# EAGLE schematic esp32board (EAGLE 9.1.2)

## Sheet 1 of 2
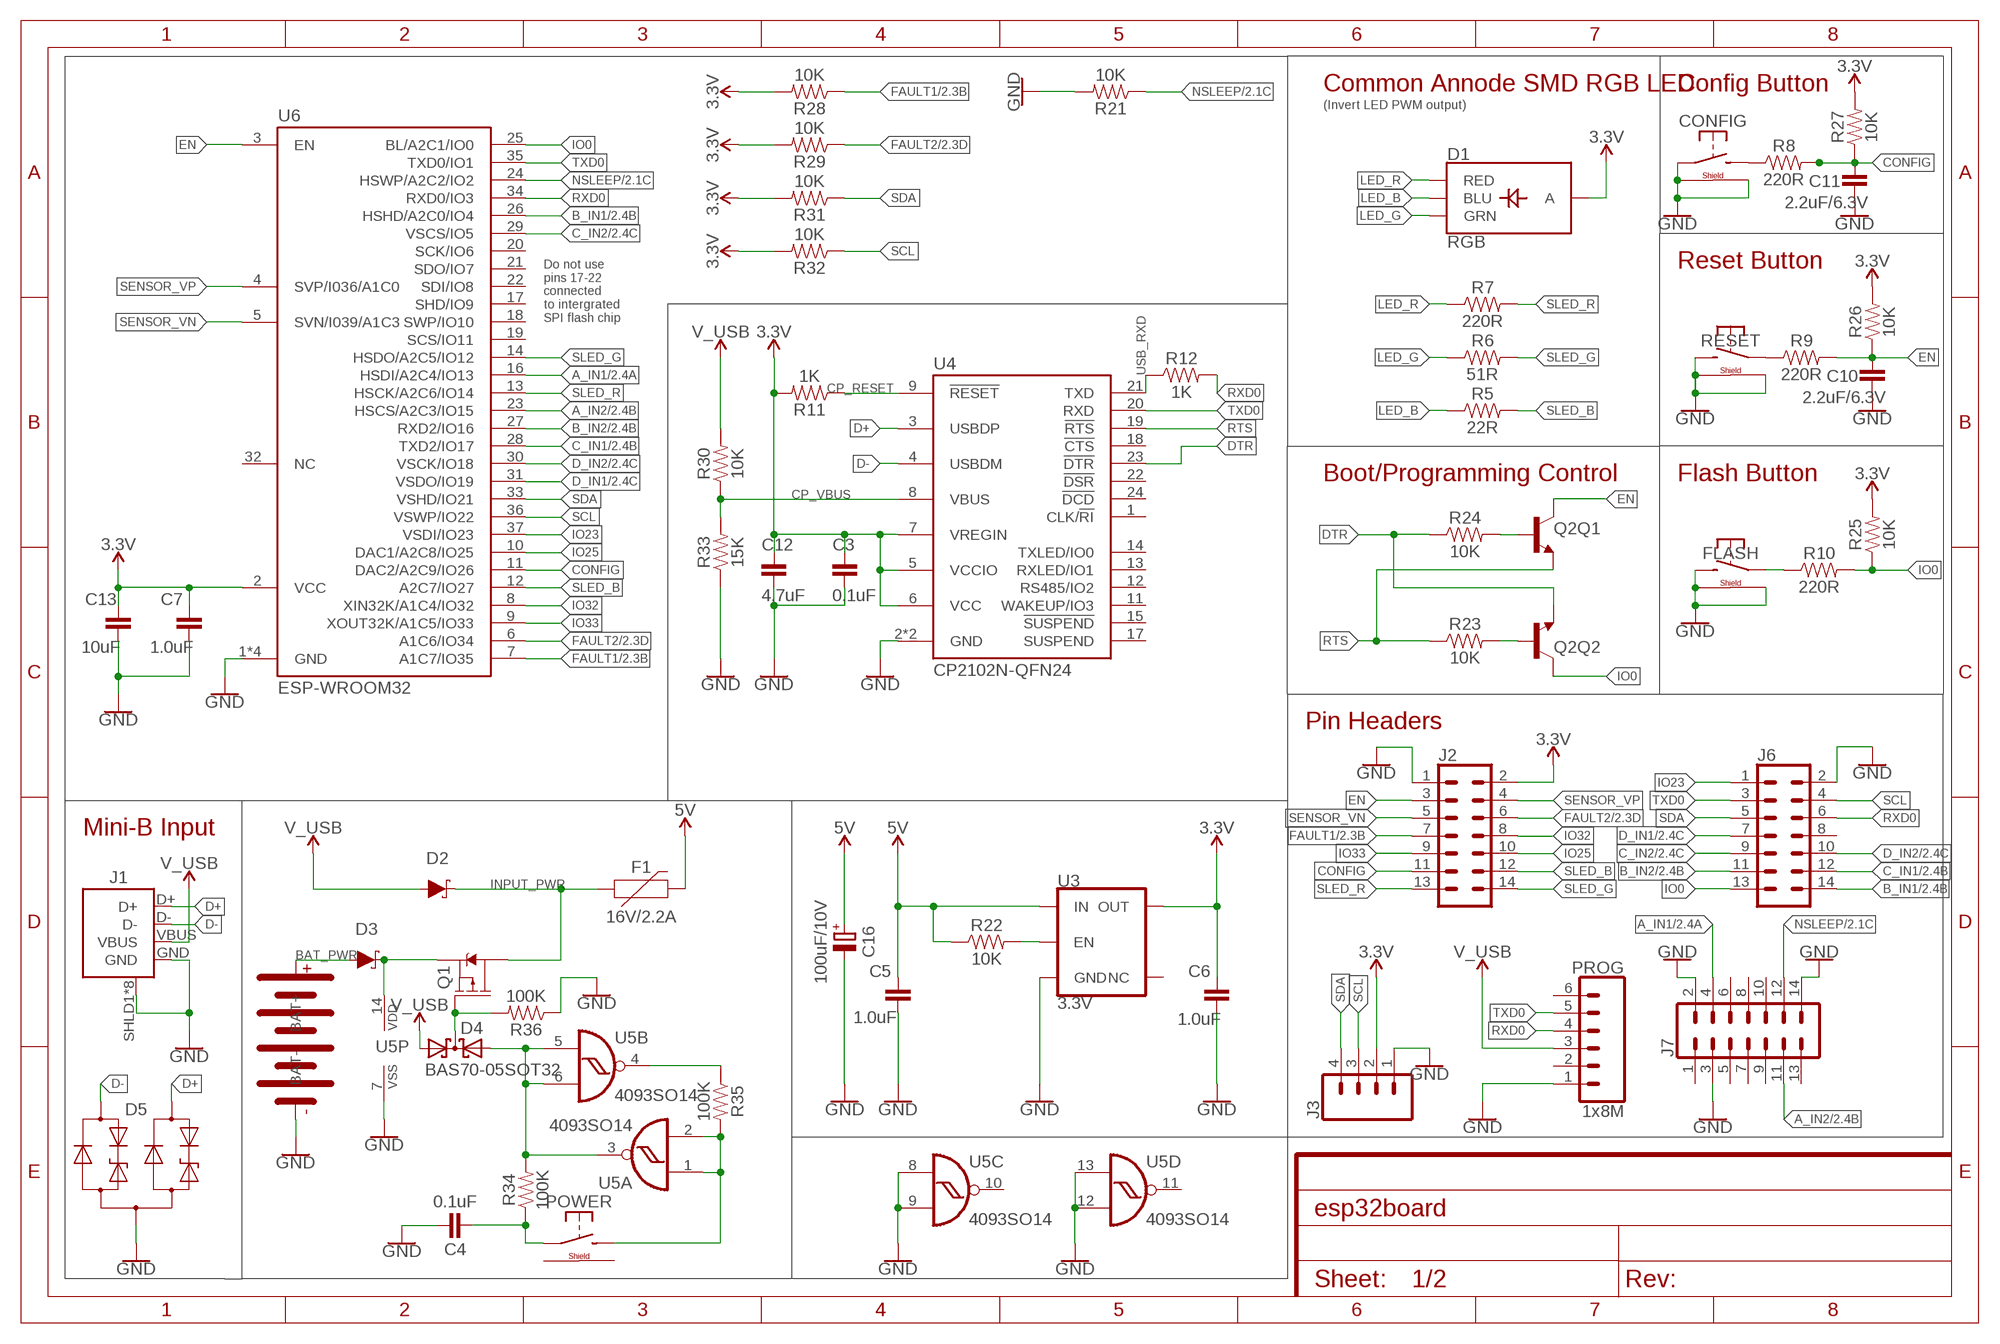
[diagram p0: schematic, sheet 1]
FRAME1 (FRAME-A4L): CNAME: VibHub ESP8266 Devboard; CREVISION: 0.1; DESIGNER: Kadah

### Parts
BAT  BC4AAPCBC4AAPC  [BC4AAPC]
C3  0.1uF  CAPACITOR-0805  [C0805]
C4  0.1uF  CAPACITOR-0805  [C0805]
C5  1.0uF  CAPACITOR-0805  [C0805]
C6  1.0uF  CAPACITOR-0805  [C0805]
C7  1.0uF  CAPACITOR-0805  [C0805]
C10  2.2uF/6.3V  CAPACITOR-0805  [C0805]
C11  2.2uF/6.3V  CAPACITOR-0805  [C0805]
C12  4.7uF  CAPACITOR-0805  [C0805]
C13  10uF  CAPACITOR-0805  [C0805]
C16  100uF/10V  CAPACITOR_POLPANASONIC_D  [PANASONIC_D]
CONFIG  MOMENTARY-SWITCH-SPST-RIGHTSQ75  [SW6X6_RIGHT_SQ73]
D1  RGB  LED-RGB-CAPLCC  [P-LCC-4-3]
D2  3A/40V/500mV  DIODE-SCHOTTKY-B340A  [SMA-DIODE]
D3  3A/40V/500mV  DIODE-SCHOTTKY-B340A  [SMA-DIODE]
D4  BAS70-05SOT32  [SOT91P240X110-3]
D5  D_ESD5V3U2U-03F  [SOT723]
F1  16V/2.2A  PPTC1812  [FUSC7035X90]
FLASH  MOMENTARY-SWITCH-SPST-RIGHTSQ75  [SW6X6_RIGHT_SQ73]
J1  USB-MICROB-2  [USB-MICROB-10118194]
J2  CONN_07X2  [2X7]
J3  CONN_04  [1X04]
J6  CONN_07X2  [2X7]
J7  CONN_07X2  [2X7]
POWER  MOMENTARY-SWITCH-SPST-RIGHTSQ75  [SW6X6_RIGHT_SQ73]
PROG  1x8M  CONN_06LOCK  [1X06_LOCK]
Q1  MOSFET_PCH-DMG2305UX-13  [SOT91P240X110-3]
Q2  TRANS_NPN_DUAL-MBT3904DW1T1  [SC70-6]
R5  22R  RESISTOR0805  [0805]
R6  51R  RESISTOR0805  [0805]
R7  220R  RESISTOR0805  [0805]
R8  220R  RESISTOR0805  [0805]
R9  220R  RESISTOR0805  [0805]
R10  220R  RESISTOR0805  [0805]
R11  1K  RESISTOR0805  [0805]
R12  1K  RESISTOR0805  [0805]
R21  10K  RESISTOR0805  [0805]
R22  10K  RESISTOR0805  [0805]
R23  10K  RESISTOR0805  [0805]
R24  10K  RESISTOR0805  [0805]
R25  10K  RESISTOR0805  [0805]
R26  10K  RESISTOR0805  [0805]
R27  10K  RESISTOR0805  [0805]
R28  10K  RESISTOR0805  [0805]
R29  10K  RESISTOR0805  [0805]
R30  10K  RESISTOR0805  [0805]
R31  10K  RESISTOR0805  [0805]
R32  10K  RESISTOR0805  [0805]
R33  15K  RESISTOR0805  [0805]
R34  100K  RESISTOR0805  [0805]
R35  100K  RESISTOR0805  [0805]
R36  100K  RESISTOR0805  [0805]
RESET  MOMENTARY-SWITCH-SPST-RIGHTSQ75  [SW6X6_RIGHT_SQ73]
U3  3.3V  V_REG_AP2112K-3.3V  [SOT23-5]
U4  CP2102N-QFN24  [QFN24-PAD]
U5  4093SO14  [SOIC127P600X175-14]
U6  ESP-WROOM32  [ESP-WROOM32]

### Nets
3.3V: C3.1 C6.1 C7.1 C12.1 C13.1 D1.4(A) J2.2 J3.2 R11.2 R25.2 R26.2 R27.2 R28.2 R29.2 R31.2 R32.2 U3.5(OUT) U4.5(VCCIO) U4.6(VCC) U4.7(VREGIN) U6.2(VCC)
5V: C5.1 C16.+ F1.2 R22.1 U3.1(IN) ; also sheet 2
A_IN1: J7.4 U6.16(HSDI/A2C4/IO13) ; also sheet 2
A_IN2: J7.11 U6.23(HSCS/A2C3/IO15) ; also sheet 2
B_IN1: J6.14 U6.26(HSHD/A2C0/IO4) ; also sheet 2
B_IN2: J6.11 U6.27(RXD2/IO16) ; also sheet 2
BAT_PWR: BAT.P$1(BAT+) D3.A
C_IN1: J6.12 U6.28(TXD2/IO17) ; also sheet 2
C_IN2: J6.9 U6.29(VSCS/IO5) ; also sheet 2
CONFIG: C11.1 J2.11 R8.2 R27.1 U6.11(DAC2/A2C9/IO26)
CP_RESET: R11.1 U4.9(!RESET)
CP_VBUS: R30.1 R33.2 U4.8(VBUS)
D+: D5.2(C2) J1.D+ U4.3(USBDP)
D-: D5.1(C1) J1.D- U4.4(USBDM)
D_IN1: J6.7 U6.31(VSDO/IO19) ; also sheet 2
D_IN2: J6.10 U6.30(VSCK/IO18) ; also sheet 2
DTR: Q2.1(Q2:E) R24.1 U4.23(!DTR)
EN: C10.1 J2.3 Q2.3(Q1:C) R9.2 R26.1 U6.3(EN)
EN_BASE: Q2.5(Q1:B) R24.2
FAULT1: J2.7 R28.1 U6.7(A1C7/IO35) ; also sheet 2
FAULT2: J2.6 R29.1 U6.6(A1C6/IO34) ; also sheet 2
GND: BAT.P$2(BAT-) C3.2 C4.2 C5.2 C6.2 C7.2 C10.2 C11.2 C12.2 C13.2 C16.- CONFIG.2(P1) CONFIG.SHLD@1(SHIELD1) CONFIG.SHLD@2(SHIELD2) D5.3(A) FLASH.1(S1) FLASH.SHLD@1(SHIELD1) FLASH.SHLD@2(SHIELD2) J1.GND J1.SHLD1(SHIELD) J1.SHLD2(SHIELD) J1.SHLD3(SHIELD) J1.SHLD4(SHIELD) J1.SHLD5(SHIELD) J1.SHLD6(SHIELD) J1.SHLD7(SHIELD) J1.SHLD8(SHIELD) J2.1 J3.1 J6.2 J7.2 J7.3 J7.14 PROG.1 R21.2 R33.1 R36.1 RESET.1(S1) RESET.SHLD@1(SHIELD1) RESET.SHLD@2(SHIELD2) U3.2(GND) U4.2(GND) U4.TP(GND) U5.7(P:VSS) U5.8(C:I0) U5.9(C:I1) U5.12(D:I1) U5.13(D:I0) U6.1(GND) U6.15(GND) U6.38(GND) U6.TP(GND) ; also sheet 2
INPUT_PWR: D2.C F1.1 Q1.3(D)
IO0: J6.13 Q2.6(Q2:C) R10.2 R25.1 U6.25(BL/A2C1/IO0)
IO0_BASE: Q2.2(Q2:B) R23.2
IO23: J6.1 U6.37(VSDI/IO23)
IO25: J2.10 U6.10(DAC1/A2C8/IO25)
IO32: J2.8 U6.8(XIN32K/A1C4/IO32)
IO33: J2.9 U6.9(XOUT32K/A1C5/IO33)
LED_B: D1.3(BLU) R5.1
LED_G: D1.2(GRN) R6.1
LED_R: D1.1(RED) R7.1
N$1: R22.2 U3.3(EN)
N$10: D3.C Q1.2(S) U5.14(P:VDD)
N$11: POWER.1(S1) R35.2 U5.1(A:I0) U5.2(A:I1)
N$12: CONFIG.1(S1) R8.1
N$13: D4.2(A2) R34.2 U5.3(A:O) U5.5(B:I0) U5.6(B:I1)
N$15: D4.3(C) Q1.1(G) R36.2
N$16: R35.1 U5.4(B:O)
N$18: C4.1 POWER.2(P1) R34.1
N$31: FLASH.2(P1) R10.1
N$37: R9.1 RESET.2(P1)
NSLEEP: J7.12 R21.1 U6.24(HSWP/A2C2/IO2) ; also sheet 2
RTS: Q2.4(Q1:E) R23.1 U4.19(!RTS)
RXD0: J6.6 PROG.4 R12.2 U6.34(RXD0/IO3)
SCL: J3.3 J6.4 R32.1 U6.36(VSWP/IO22)
SDA: J3.4 J6.5 R31.1 U6.33(VSHD/IO21)
SENSOR_VN: J2.5 U6.5(SVN/I039/A1C3)
SENSOR_VP: J2.4 U6.4(SVP/I036/A1C0)
SLED_B: J2.12 R5.2 U6.12(A2C7/IO27)
SLED_G: J2.14 R6.2 U6.14(HSDO/A2C5/IO12)
SLED_R: J2.13 R7.2 U6.13(HSCK/A2C6/IO14)
TXD0: J6.3 PROG.5 U4.20(RXD) U6.35(TXD0/IO1)
USB_RXD: R12.1 U4.21(TXD)
V_USB: D2.A D4.1(A1) J1.VBUS PROG.3 R30.2
Unconnected: J6.8 J7.1 J7.5 J7.6 J7.7 J7.8 J7.9 J7.10 J7.13 POWER.SHLD@1(SHIELD1) POWER.SHLD@2(SHIELD2) PROG.2 PROG.6 U3.4(NC) U4.1(CLK/!RI) U4.11(WAKEUP/IO3) U4.12(RS485/IO2) U4.13(RXLED/IO1) U4.14(TXLED/IO0) U4.15(!SUSPEND) U4.17(SUSPEND) U4.18(!CTS) U4.22(!DSR) U4.24(!DCD) U5.10(C:O) U5.11(D:O) U6.17(SHD/IO9) U6.18(SWP/IO10) U6.19(SCS/IO11) U6.20(SCK/IO6) U6.21(SDO/IO7) U6.22(SDI/IO8) U6.32(NC)

### Notes on the sheet
- Common Annode SMD RGB LED | Config Button
- (Invert LED PWM output)
- Reset Button
- Do not use
  pins 17-22
  connected
  to intergrated
  SPI flash chip
- Boot/Programming Control | Flash Button
- Pin Headers
- Mini-B Input

## Sheet 2 of 2
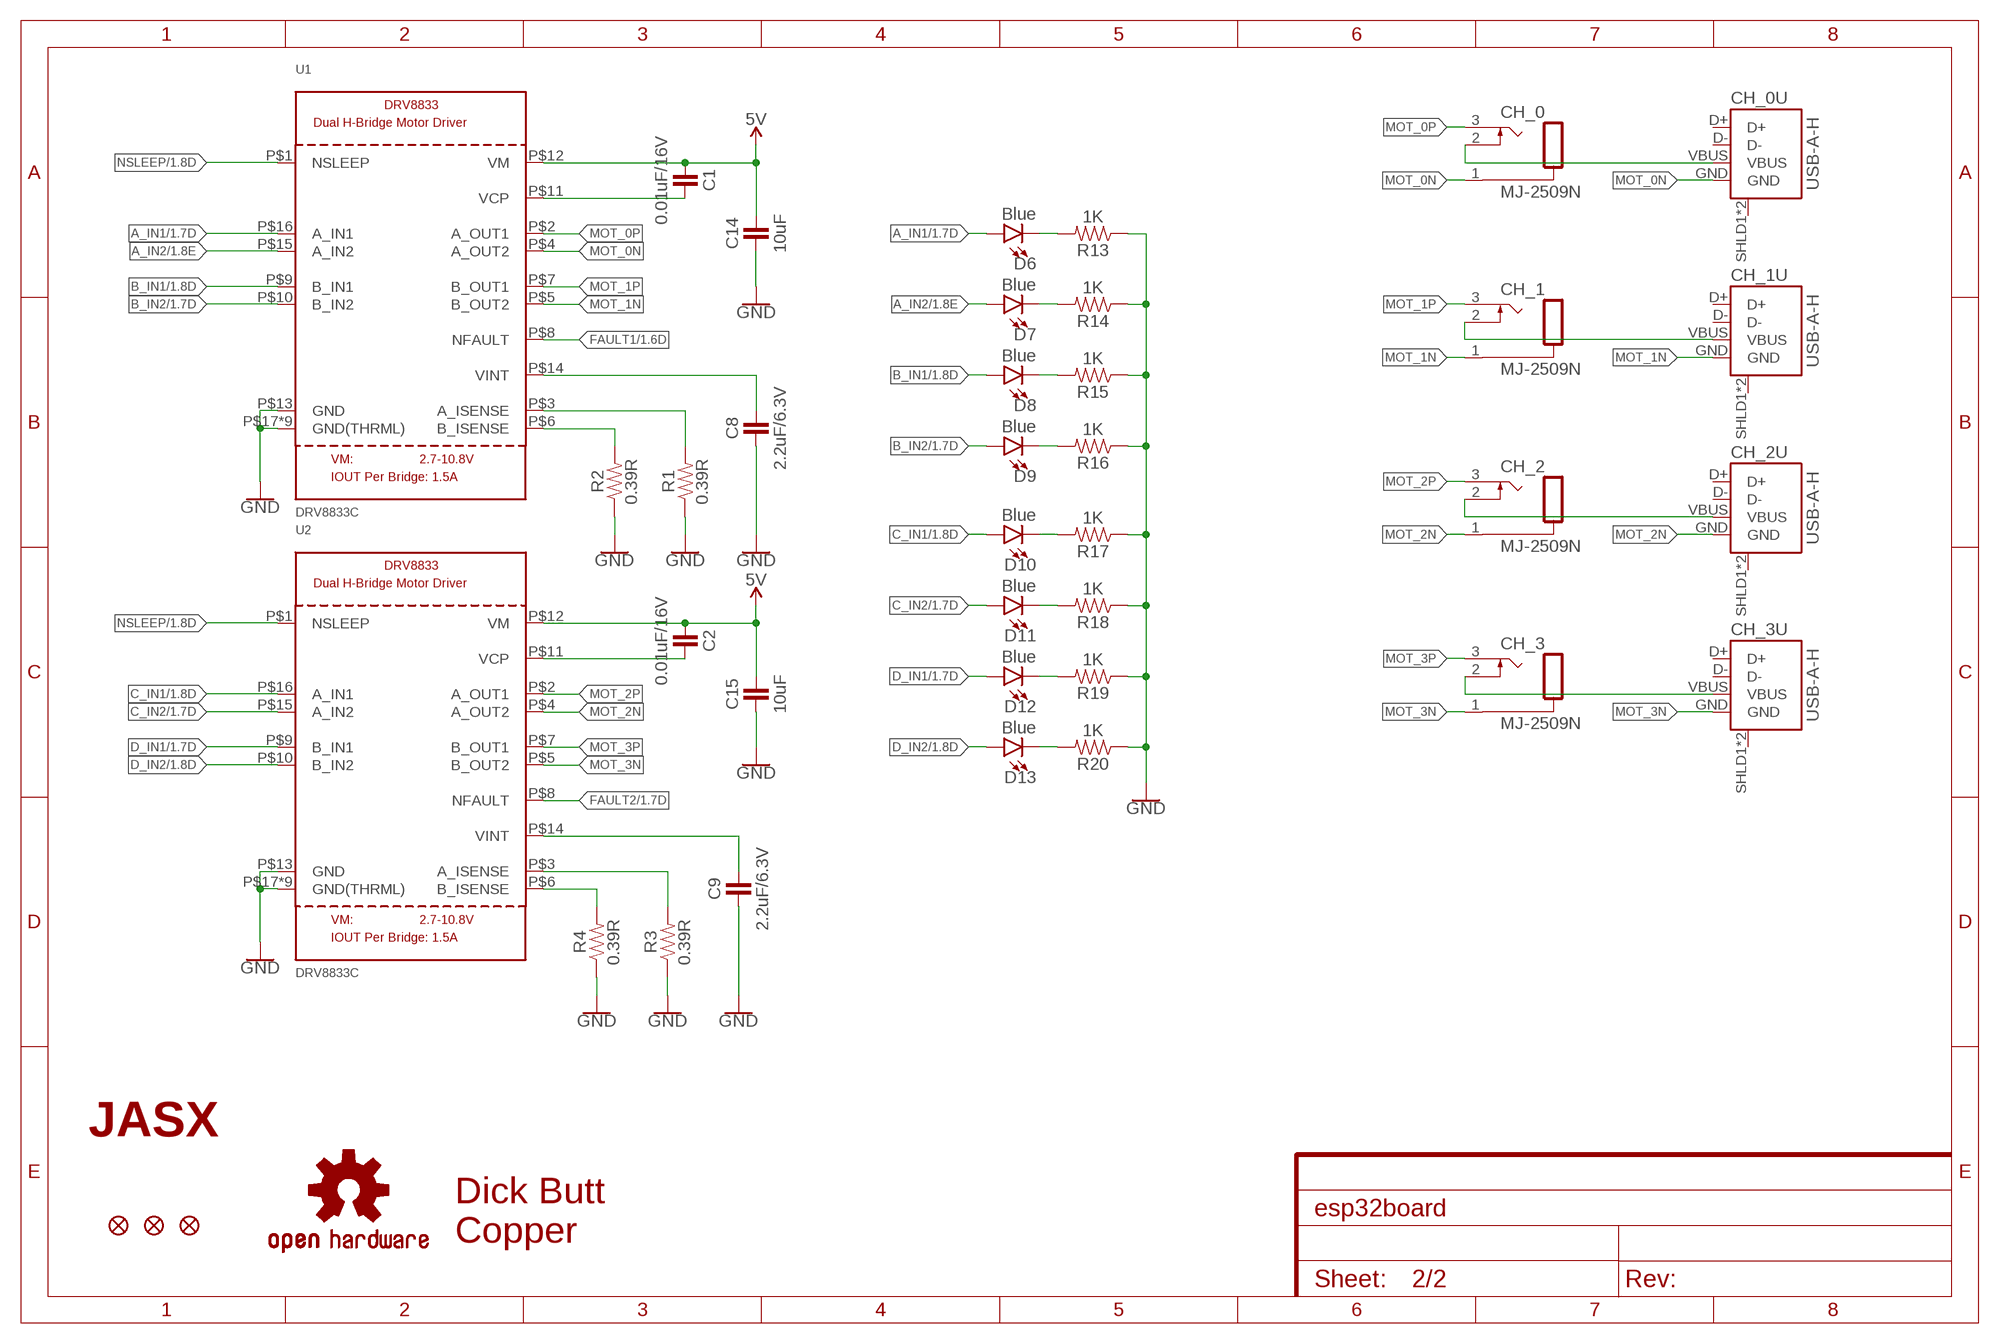
[diagram p1: schematic, sheet 2]

### Parts
C1  0.01uF/16V  CAPACITOR-0805  [C0805]
C2  0.01uF/16V  CAPACITOR-0805  [C0805]
C8  2.2uF/6.3V  CAPACITOR-0805  [C0805]
C9  2.2uF/6.3V  CAPACITOR-0805  [C0805]
C14  10uF  CAPACITOR-0805  [C0805]
C15  10uF  CAPACITOR-0805  [C0805]
CH_0  MJ-2509N  [MJ-2509N]
CH_0U  USB-A-H  [USB-A-H]
CH_1  MJ-2509N  [MJ-2509N]
CH_1U  USB-A-H  [USB-A-H]
CH_2  MJ-2509N  [MJ-2509N]
CH_2U  USB-A-H  [USB-A-H]
CH_3  MJ-2509N  [MJ-2509N]
CH_3U  USB-A-H  [USB-A-H]
D6  Blue  LED0805  [CHIPLED_0805]
D7  Blue  LED0805  [CHIPLED_0805]
D8  Blue  LED0805  [CHIPLED_0805]
D9  Blue  LED0805  [CHIPLED_0805]
D10  Blue  LED0805  [CHIPLED_0805]
D11  Blue  LED0805  [CHIPLED_0805]
D12  Blue  LED0805  [CHIPLED_0805]
D13  Blue  LED0805  [CHIPLED_0805]
FD1  FIDUCIAL1X2  [FIDUCIAL-1X2]
FD2  FIDUCIAL1X2  [FIDUCIAL-1X2]
FD3  FIDUCIAL1X2  [FIDUCIAL-1X2]
LOGO1  OSHW-LOGOM  [OSHW-LOGO-M]
LOGO2  JASX_LOGO_MID  [JASX_LOGO_M]
LOGO3  DICKBUTTCOPPER  [DICKBUTT_COPPER]
R1  0.39R  RESISTOR0805  [0805]
R2  0.39R  RESISTOR0805  [0805]
R3  0.39R  RESISTOR0805  [0805]
R4  0.39R  RESISTOR0805  [0805]
R13  1K  RESISTOR0805  [0805]
R14  1K  RESISTOR0805  [0805]
R15  1K  RESISTOR0805  [0805]
R16  1K  RESISTOR0805  [0805]
R17  1K  RESISTOR0805  [0805]
R18  1K  RESISTOR0805  [0805]
R19  1K  RESISTOR0805  [0805]
R20  1K  RESISTOR0805  [0805]
U1  DRV8833C  DRV8833  [HTSSOP16]
U2  DRV8833C  DRV8833  [HTSSOP16]

### Nets
5V: C1.1 C2.1 C14.2 C15.2 U1.P$12(VM) U2.P$12(VM) ; also sheet 1
A_IN1: D6.A U1.P$16(A_IN1) ; also sheet 1
A_IN2: D7.A U1.P$15(A_IN2) ; also sheet 1
A_ISENSE0: R1.2 U1.P$3(A_ISENSE)
A_ISENSE1: R3.2 U2.P$3(A_ISENSE)
B_IN1: D8.A U1.P$9(B_IN1) ; also sheet 1
B_IN2: D9.A U1.P$10(B_IN2) ; also sheet 1
B_ISENSE0: R2.2 U1.P$6(B_ISENSE)
B_ISENSE1: R4.2 U2.P$6(B_ISENSE)
C_IN1: D10.A U2.P$16(A_IN1) ; also sheet 1
C_IN2: D11.A U2.P$15(A_IN2) ; also sheet 1
D_IN1: D12.A U2.P$9(B_IN1) ; also sheet 1
D_IN2: D13.A U2.P$10(B_IN2) ; also sheet 1
FAULT1: U1.P$8(NFAULT) ; also sheet 1
FAULT2: U2.P$8(NFAULT) ; also sheet 1
GND: C8.1 C9.1 C14.1 C15.1 R1.1 R2.1 R3.1 R4.1 R13.1 R14.1 R15.1 R16.1 R17.1 R18.1 R19.1 R20.1 U1.P$13(GND) U1.P$17(GND(THRML)) U1.P$18(GND(THRML)) U1.P$19(GND(THRML)) U1.P$20(GND(THRML)) U1.P$21(GND(THRML)) U1.P$22(GND(THRML)) U1.P$23(GND(THRML)) U1.P$24(GND(THRML)) U1.P$25(GND(THRML)) U2.P$13(GND) U2.P$17(GND(THRML)) U2.P$18(GND(THRML)) U2.P$19(GND(THRML)) U2.P$20(GND(THRML)) U2.P$21(GND(THRML)) U2.P$22(GND(THRML)) U2.P$23(GND(THRML)) U2.P$24(GND(THRML)) U2.P$25(GND(THRML)) ; also sheet 1
MOT_0N: CH_0.1(S) CH_0U.GND U1.P$4(A_OUT2)
MOT_0P: CH_0.3(T) U1.P$2(A_OUT1)
MOT_1N: CH_1.1(S) CH_1U.GND U1.P$5(B_OUT2)
MOT_1P: CH_1.3(T) U1.P$7(B_OUT1)
MOT_2N: CH_2.1(S) CH_2U.GND U2.P$4(A_OUT2)
MOT_2P: CH_2.3(T) U2.P$2(A_OUT1)
MOT_3N: CH_3.1(S) CH_3U.GND U2.P$5(B_OUT2)
MOT_3P: CH_3.3(T) U2.P$7(B_OUT1)
N$2: D6.C R13.2
N$3: D7.C R14.2
N$4: D8.C R15.2
N$5: D9.C R16.2
N$6: D10.C R17.2
N$7: D11.C R18.2
N$8: D12.C R19.2
N$9: D13.C R20.2
N$14: CH_3.2(TS) CH_3U.VBUS
N$32: CH_0.2(TS) CH_0U.VBUS
N$33: CH_1.2(TS) CH_1U.VBUS
N$34: CH_2.2(TS) CH_2U.VBUS
NSLEEP: U1.P$1(NSLEEP) U2.P$1(NSLEEP) ; also sheet 1
VCP0: C1.2 U1.P$11(VCP)
VCP1: C2.2 U2.P$11(VCP)
VINT0: C8.2 U1.P$14(VINT)
VINT1: C9.2 U2.P$14(VINT)
Unconnected: CH_0U.D+ CH_0U.D- CH_0U.SHLD1(SHIELD) CH_0U.SHLD2(SHIELD) CH_1U.D+ CH_1U.D- CH_1U.SHLD1(SHIELD) CH_1U.SHLD2(SHIELD) CH_2U.D+ CH_2U.D- CH_2U.SHLD1(SHIELD) CH_2U.SHLD2(SHIELD) CH_3U.D+ CH_3U.D- CH_3U.SHLD1(SHIELD) CH_3U.SHLD2(SHIELD)

## Library data of the parts
BAT = vibhud:BC4AAPC
C1-C15 = vibhud:CAPACITOR: Capacitors ...2.2uF @ 6.3V -> 0402 ...4.7uF @ 6.3V -> 0603 ...10uF @ 16V -> 0805 ...22uF @ 25V -> 1206
C16 = vibhud:CAPACITOR_POL: Polarized Capacitors
CH_0 CH_1-CH_3 = vibhud:MJ-2509N: Mono Audio Jack, 2.5 MM
CH_0U CH_1U CH_2U CH_3U = vibhud:USB: USB Connectors
CONFIG FLASH POWER RESET = vibhud:MOMENTARY-SWITCH-SPST-RIGHT
D1 = vibhud:LED-RGB-CA: LED-RGB Diffused Common Anode Packages: LED RGB-THRU P-LCC-4-3 LED-TRICOLOR-SMD SparkFun Products: RGB Diffused Common Anode- Diffuse <[https://www.sparkfun.com/products/10821]> RGB Diffused Common Anode - Clear <[https://www.sparkfun.com/products/10820]> Qduino Mini <[https://www.sparkfun.com/products/13614]> Triple Output LED RGB - SMD <https://www.sparkfun.com/products/7844>; PROD_ID: DIO-12986
D2 D3 = vibhud:DIODE-SCHOTTKY: Schottky diode A Schottky diode is a semiconductor diode which has a low forward voltage drop and a very fast switching action.; PROD_ID: DIO-09886
D4 = vibhud:BAS70-05: Silicon Schottky Diodes General-purpose diode for high-speed switching
D5 = vibhud:D_ESD5V3U2U: TVS Diode - Uni-directional Ultra Low ESD / Transient Protection Diode Vrwm=5.3V, 0.4pF@1MHz; DIGIKEY: ESD5V3U2U-03F H6327DKR-ND
D6-D13 = vibhud:LED: LED (Generic) Standard schematic elements and footprints for 5mm, 3mm, 1206, and 0603 sized LEDs. Generic LEDs with no color specified.
F1 = vibhud:PPTC: Resettable Fuse PPTC Resettable Fuse. Really a sort of resistor with a polymeric positive temperature coefficient whose resistance increases dramatically with an increase in temperature. When heated by the power passing through the resistance rises causing the current to be limited, protecting the circuit. This is achieved by the transition of the polymer from a crystalline to an amorphous state where the conductive carbon separates breaking the conductive pathways found in the cool crystalline structure. When a PPTC cools back down it resumes conducting letting the circuit turn back on. SparkFun Products: SparkFun RedBoard - Programmed with Arduino <https://www.sparkfun.com/products/12757> Pro Micro - 5V/16MHz <https://www.sparkfun.com/products/12640> Arduino Pro 328 - 5V/16MHz <https://www.sparkfun.com/products/10915> MP3 Trigger <https://www.sparkfun.com/products/13720>
FD1-FD3 = vibhud:FIDUCIAL: Fiducial Alignment Points Point-of-reference for pick-and-place machines and other optical instruments.
J1 = vibhud:USB: USB Connectors; DIGIKEY: 609-4618-6-ND
J2 J6 J7 = vibhud:CONN_07X2: Multi connection point. Often used as Generic Header-pin footprint for 0.1 inch spaced/style header connections You can populate with any combo of single row headers, but if you'd like an exact match, check this: Header - 2x8 (Male, 0.1") <https://www.sparkfun.com/products/13156> (PRT-13156) On any of the 0.1 inch spaced packages, you can populate with these: Break Away Headers - Straight <https://www.sparkfun.com/products/116> (PRT-00116) Break Away Male Headers - Right Angle <https://www.sparkfun.com/products/553> (PRT-00553) Female Headers <https://www.sparkfun.com/products/115> (PRT-00115) Break Away Headers - Machine Pin <https://www.sparkfun.com/products/117> (PRT-00117) Break Away Female Headers - Swiss Machine Pin <https://www.sparkfun.com/products/743> (PRT-00743)
J3 = vibhud:CONN_04: Multi connection point. Often used as Generic Header-pin footprint for 0.1 inch spaced/style header connections On any of the 0.1 inch spaced packages, you can populate with these: Break Away Headers - Straight <https://www.sparkfun.com/products/116> (PRT-00116) Break Away Male Headers - Right Angle <https://www.sparkfun.com/products/553> (PRT-00553) Female Headers <https://www.sparkfun.com/products/115> (PRT-00115) Break Away Headers - Machine Pin <https://www.sparkfun.com/products/117> (PRT-00117) Break Away Female Headers - Swiss Machine Pin <https://www.sparkfun.com/products/743> (PRT-00743) For SCREWTERMINALS and SPRING TERMINALS visit here: Screw Terimnals on SparkFun.com <https://www.sparkfun.com/search/results?term=Screw+Terminals> (5mm/3.5mm/2.54mm spacing) This device is also useful as a general connection point to wire up your design to another part of your project. Our various solder wires solder well into these plated through hole pads. Hook-Up Wire - Assortment (Stranded, 22 AWG) <https://www.sparkfun.com/products/11375> (PRT-11375) Hook-Up Wire - Assortment (Solid Core, 22 AWG) <https://www.sparkfun.com/products/11367> (PRT-11367) View the entire wire category on our website here <https://www.sparkfun.com/categories/141> Special notes: Molex polarized connector foot print use with SKU : PRT-08231 with associated crimp pins and housings. 1MM SMD Version SKU: PRT-10208; PROD_ID: CONN-09696
LOGO1 = vibhud:OSHW-LOGO: Open-Source Hardware (OSHW) Logo This logo indicates the piece of hardware it is found on incorporates a OSHW license and/or adheres to the definition of open source hardware found here: http://freedomdefined.org/OSHW
LOGO2 = vibhud:JASX_LOGO
LOGO3 = vibhud:DICKBUTT
PROG = vibhud:CONN_06: Multi connection point. Often used as Generic Header-pin footprint for 0.1 inch spaced/style header connections On any of the 0.1 inch spaced packages, you can populate with these: Break Away Headers - Straight <https://www.sparkfun.com/products/116> (PRT-00116) Break Away Male Headers - Right Angle <https://www.sparkfun.com/products/553> (PRT-00553) Female Headers <https://www.sparkfun.com/products/115> (PRT-00115) Break Away Headers - Machine Pin <https://www.sparkfun.com/products/117> (PRT-00117) Break Away Female Headers - Swiss Machine Pin <https://www.sparkfun.com/products/743> (PRT-00743) Arduino Stackable Header - 6 Pin <https://www.sparkfun.com/products/9280> (PRT-09280) For SCREWTERMINALS and SPRING TERMINALS visit here: Screw Terimnals on SparkFun.com <https://www.sparkfun.com/search/results?term=Screw+Terminals> (5mm/3.5mm/2.54mm spacing) This device is also useful as a general connection point to wire up your design to another part of your project. Our various solder wires solder well into these plated through hole pads. Hook-Up Wire - Assortment (Stranded, 22 AWG) <https://www.sparkfun.com/products/11375> (PRT-11375) Hook-Up Wire - Assortment (Solid Core, 22 AWG) <https://www.sparkfun.com/products/11367> (PRT-11367) View the entire wire category on our website here <https://www.sparkfun.com/categories/141>
Q1 = vibhud:MOSFET_PCH: P-channel MOSFETs Voltage controlled devices that allow control of high current outputs. SparkFun Products: SparkFun ESP32 Thing <https://www.sparkfun.com/products/13907> SparkFun ESP8266 Thing <https://www.sparkfun.com/products/13231>
Q2 = vibhud:TRANS_NPN_DUAL: Dual NPN Transistors in Single Package The MBT3904W1 puts two general purpose 3904 NPN transistors in a single package. Datasheet <http://www.onsemi.com/pub_link/Collateral/MBT3904DW1T1-D.PDF> SparkFun Products: SparkFun ESP32 Thing <https://www.sparkfun.com/products/13907>; PROD_ID: TRANS-13337
R1-R36 = vibhud:RESISTOR: Generic Resistor Package
U1 U2 = vibhud:DRV8833: DRV8833 Dual H-Bridge Motor Driver -- HTSSOP Package
U3 = vibhud:V_REG_AP2112: AP2112 - 600mA CMOS LDO Regulator w/ Enable The AP2112 is CMOS process low dropout linear regulator with enable function, the regulator delivers a guaranteed 600mA (min.) continuous load current. Features Output Voltage Accuracy: ±1.5% Output Current: 600mA (Min.) Foldback Short Current Protection: 50mA Enable Function to Turn ON/OFF VOUT Low Dropout Voltage (3.3V): 250mV (Typ.) @IOUT=600mA Excellent Load Regulation: 0.2%/A (Typ.) Excellent Line Regulation: 0.02%/V (Typ.) Low Quiescent Current: 55μA (Typ.) Low Standby Current: 0.01μA (Typ.) Low Output Noise: 50μVRMS PSRR: 100Hz -65dB, 1kHz -65dB OTSD Protection Stable with 1.0μF Flexible Cap: Ceramic, Tantalum and Aluminum Electrolytic Operation Temperature Range: -40°C to 85°C ESD: MM 400V, HBM 4000V; PROD_ID: VREG-12457
U4 = vibhud:CP2102N: Silabs CP2102N USB to UART Bridge (5V tolerant inputs) CP2102N-QFN24 is pin-compatible with CP2104.
U5 = vibhud:4093: Quad 2-input NAND schmitt trigger
U6 = vibhud:ESP-WROOM32: Espressif ESP-WROOM-32 ESP32 WiFi/WLAN + Bluetooth/BLE Module Compatible with AI-Thinker ESP-32S Module.